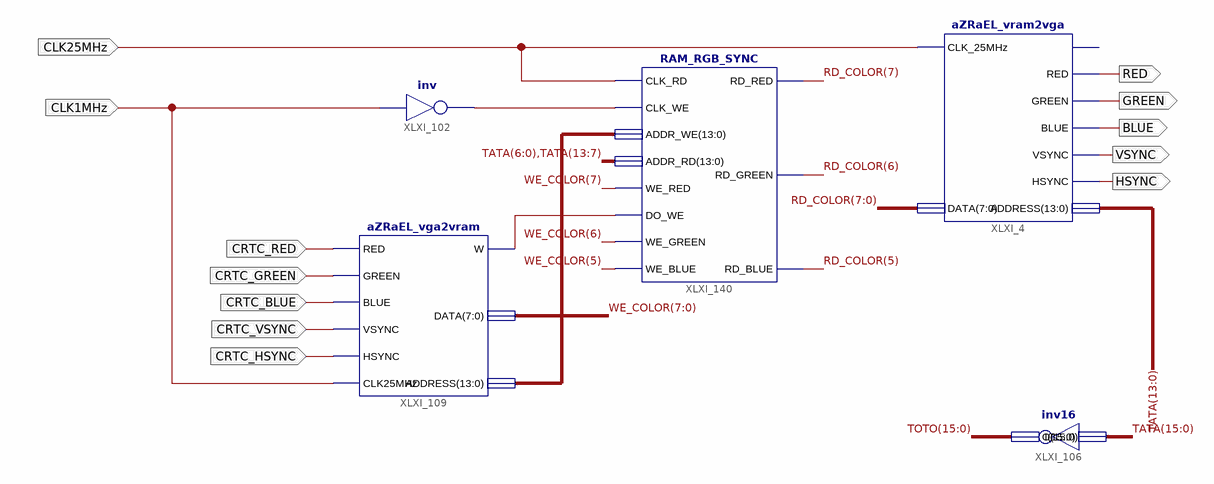
[diagram p0: schematic sheet 1]
// Xilinx ISE schematic CRTC2VGA.sch (spartan3) as structural Verilog: 5 symbols, 12 ports
module CRTC2VGA (
  input  CRTC_RED,
  input  CRTC_GREEN,
  input  CRTC_BLUE,
  input  CLK25MHz,
  input  CRTC_VSYNC,
  input  CRTC_HSYNC,
  input  CLK1MHz,
  output HSYNC,
  output VSYNC,
  output BLUE,
  output GREEN,
  output RED
);

  wire XLXN_257, XLXN_356;
  wire [7:0] RD_COLOR, WE_COLOR;
  wire [13:0] XLXN_457;
  wire [15:0] TATA, TOTO;

  aZRaEL_vga2vram XLXI_109 (
    .RED(CRTC_RED), .GREEN(CRTC_GREEN), .BLUE(CRTC_BLUE), .VSYNC(CRTC_VSYNC), .HSYNC(CRTC_HSYNC),
    .CLK25MHz(CLK1MHz), .W(XLXN_356), .DATA(WE_COLOR), .ADDRESS(XLXN_457));
  inv16 XLXI_106 (.I(TATA), .O(TOTO));
  aZRaEL_vram2vga XLXI_4 (
    .CLK_25MHz(CLK25MHz), .DATA(RD_COLOR), .RED(RED), .GREEN(GREEN), .BLUE(BLUE), .VSYNC(VSYNC),
    .HSYNC(HSYNC), .ADDRESS(TATA[13:0]));  // open: R
  RAM_RGB_SYNC XLXI_140 (
    .CLK_RD(CLK25MHz), .CLK_WE(XLXN_257), .ADDR_WE(XLXN_457), .ADDR_RD({TATA[6:0], TATA[13:7]}),
    .WE_RED(WE_COLOR[7]), .DO_WE(XLXN_356), .WE_GREEN(WE_COLOR[6]), .WE_BLUE(WE_COLOR[5]),
    .RD_RED(RD_COLOR[7]), .RD_GREEN(RD_COLOR[6]), .RD_BLUE(RD_COLOR[5]));
  not XLXI_102 (XLXN_257, CLK1MHz);
endmodule
